# Altium schematic sheet BLE_Module.SchDoc
size A4; SheetNumber: 6; SheetTotal: 8
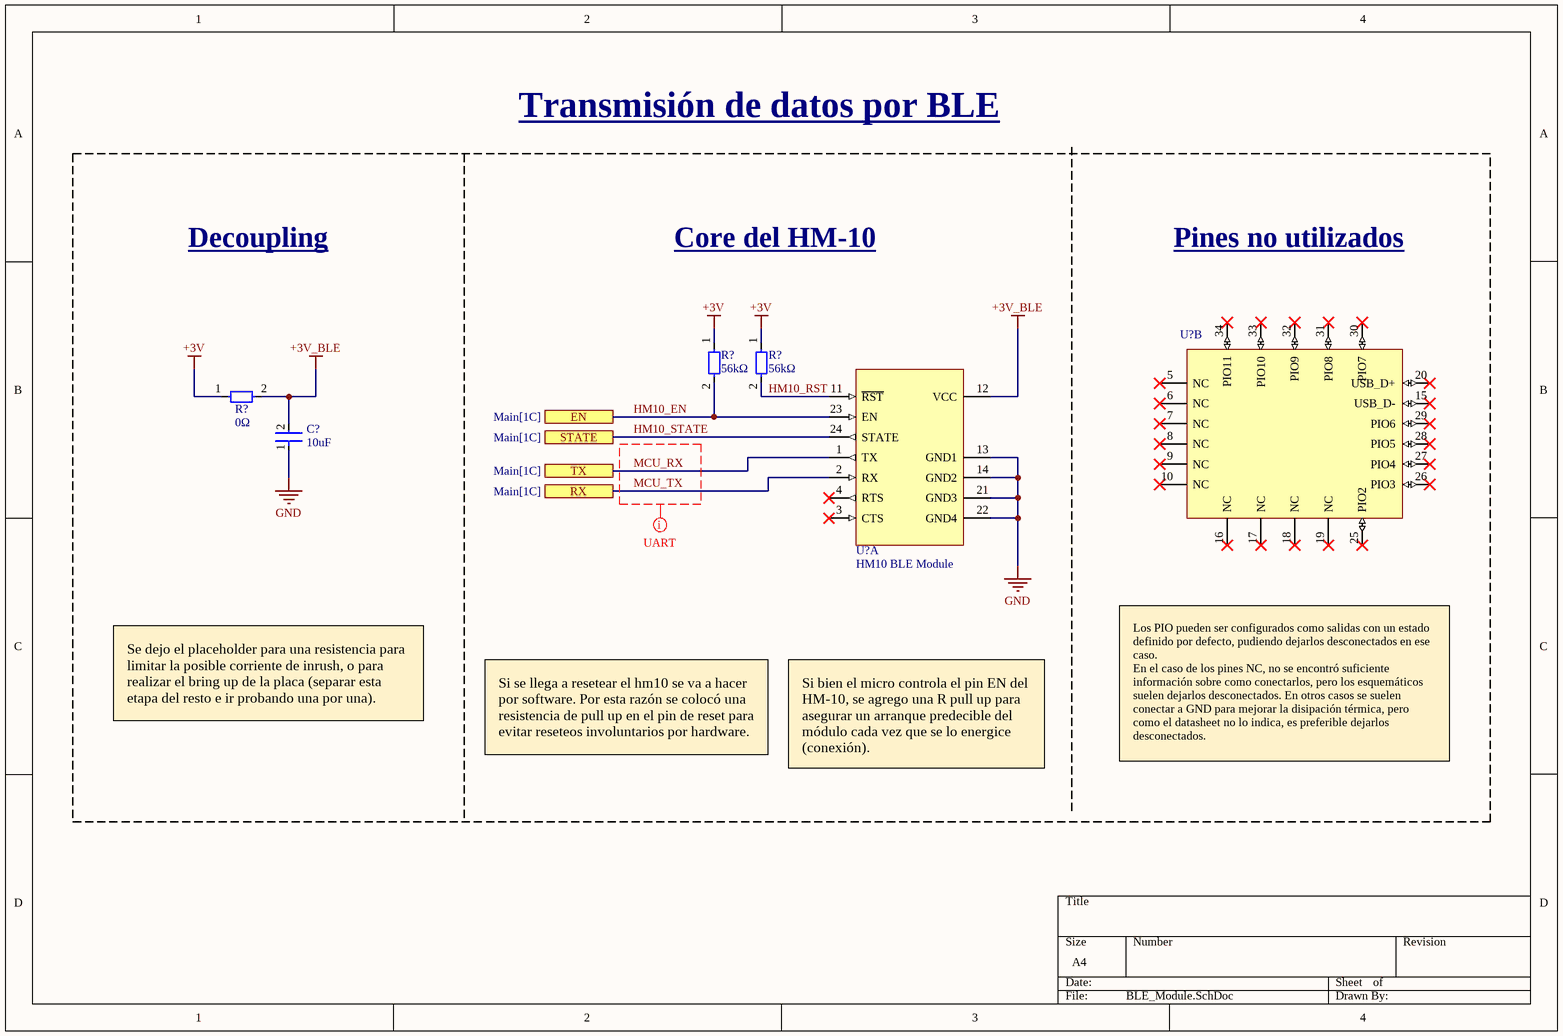
[diagram p0: BLE_Module.SchDoc]

## Parts
(Parts that share a designator on the sheet are numbered #1, #2 ... from top to bottom, then left to right.)
C?  Capacitance: 10uF  [FP-CL21-IPC_B]  (hidden comment: CL21A106KPFNNNE)
R?#1  value 56kΩ  [PACKAGE_0805]  (hidden comment: Simbolo de resistencia genérica)
R?#2  value 56kΩ  [PACKAGE_0805]  (hidden comment: Simbolo de resistencia genérica)
R?#3  value 0Ω  [PACKAGE_0805]  (hidden comment: Simbolo de resistencia genérica)
U?#1  HM10 BLE Module  [HM10_FOOTPRINT]  (part A of 2)
U?#2  HM10 BLE Module  [HM10_FOOTPRINT]  (value not drawn)  (part B of 2)

## Ports
EN (see Main[1C]), RX (see Main[1C]), STATE (see Main[1C]), TX (see Main[1C])

## Nets
+3V: R?#1.1 R?#2.1 R?#3.1
+3V_BLE: C?.2 R?#3.2 U?#1.12(VCC)
GND: C?.1 U?#1.13(GND1) U?#1.14(GND2) U?#1.21(GND3) U?#1.22(GND4)
HM10_EN: R?#1.2 U?#1.23(EN) ; port EN
HM10_RST: R?#2.2 U?#1.11(~{RST})
HM10_STATE: U?#1.24(STATE) ; port STATE
MCU_RX: U?#1.1(TX) ; port TX
MCU_TX: U?#1.2(RX) ; port RX

Not connected (* = marked no-connect by the designer): U?#1 3(CTS)* 4(RTS)*; U?#2 5(NC)* 6(NC)* 7(NC)* 8(NC)* 9(NC)* 10(NC)* 15(USB_D-)* 16(NC)* 17(NC)* 18(NC)* 19(NC)* 20(USB_D+)* 25(PIO2)* 26(PIO3)* 27(PIO4)* 28(PIO5)* 29(PIO6)* 30(PIO7)* 31(PIO8)* 32(PIO9)* 33(PIO10)* 34(PIO11)*

## Layout directives
net class UART: MCU_RX, MCU_TX

## Notes on the sheet
- Transmisión de datos por BLE
- Decoupling
- Core del HM-10
- Pines no utilizados
- Se dejo el placeholder para una resistencia para limitar la posible corriente de inrush, o para realizar el bring up de la placa (separar esta etapa del resto e ir probando una por una).
- Si se llega a resetear el hm10 se va a hacer por software. Por esta razón se colocó una resistencia de pull up en el pin de reset para evitar reseteos involuntarios por hardware.
- Si bien el micro controla el pin EN del HM-10, se agrego una R pull up para asegurar un arranque predecible del módulo cada vez que se lo energice (conexión).
- Los PIO pueden ser configurados como salidas con un estado definido por defecto, pudiendo dejarlos desconectados en ese caso.
  En el caso de los pines NC, no se encontró suficiente información sobre como conectarlos, pero los esquemáticos suelen dejarlos desconectados. En otros casos se suelen conectar a GND para mejorar la disipación térmica, pero como el datasheet no lo indica, es preferible dejarlos desconectados.

## Library data of the parts
C? = CMP-2000-06103-2: CL21 Series 0805 10uF 10V ±10% Tolerance X5R Multilayer Ceramic Chip Capacitor; Case Code (Imperial): 0805; Mount: Surface Mount; Depth: 1.25mm; Length: 2mm; Lead Free: Lead Free; Packaging: Tape and Reel; Dielectric: X5R; Width: 0.049inch; Package Quantity: 1; Height: 1.25mm; Case/Package: 0805; Voltage Rating: 10V; Thickness: 0.053inch; Max Operating Temperature: 85°C; Tolerance: 10%; Case Code (Metric): 2012; Contact Plating: Tin; Min Operating Temperature: -55°C; Radiation Hardening: No; Voltage Rating (DC): 10V
R?#1-R?#3 = Generic R
U?#1 U?#2 = HM10: Modulo BLE HM10 con castellated pads.